# EAGLE design MBT42Q_CR2032_v01 (EAGLE 7.3.0)
COMPANY: ADAFRUIT INDUSTRIES; DRAWN: KTOWN; REV: F
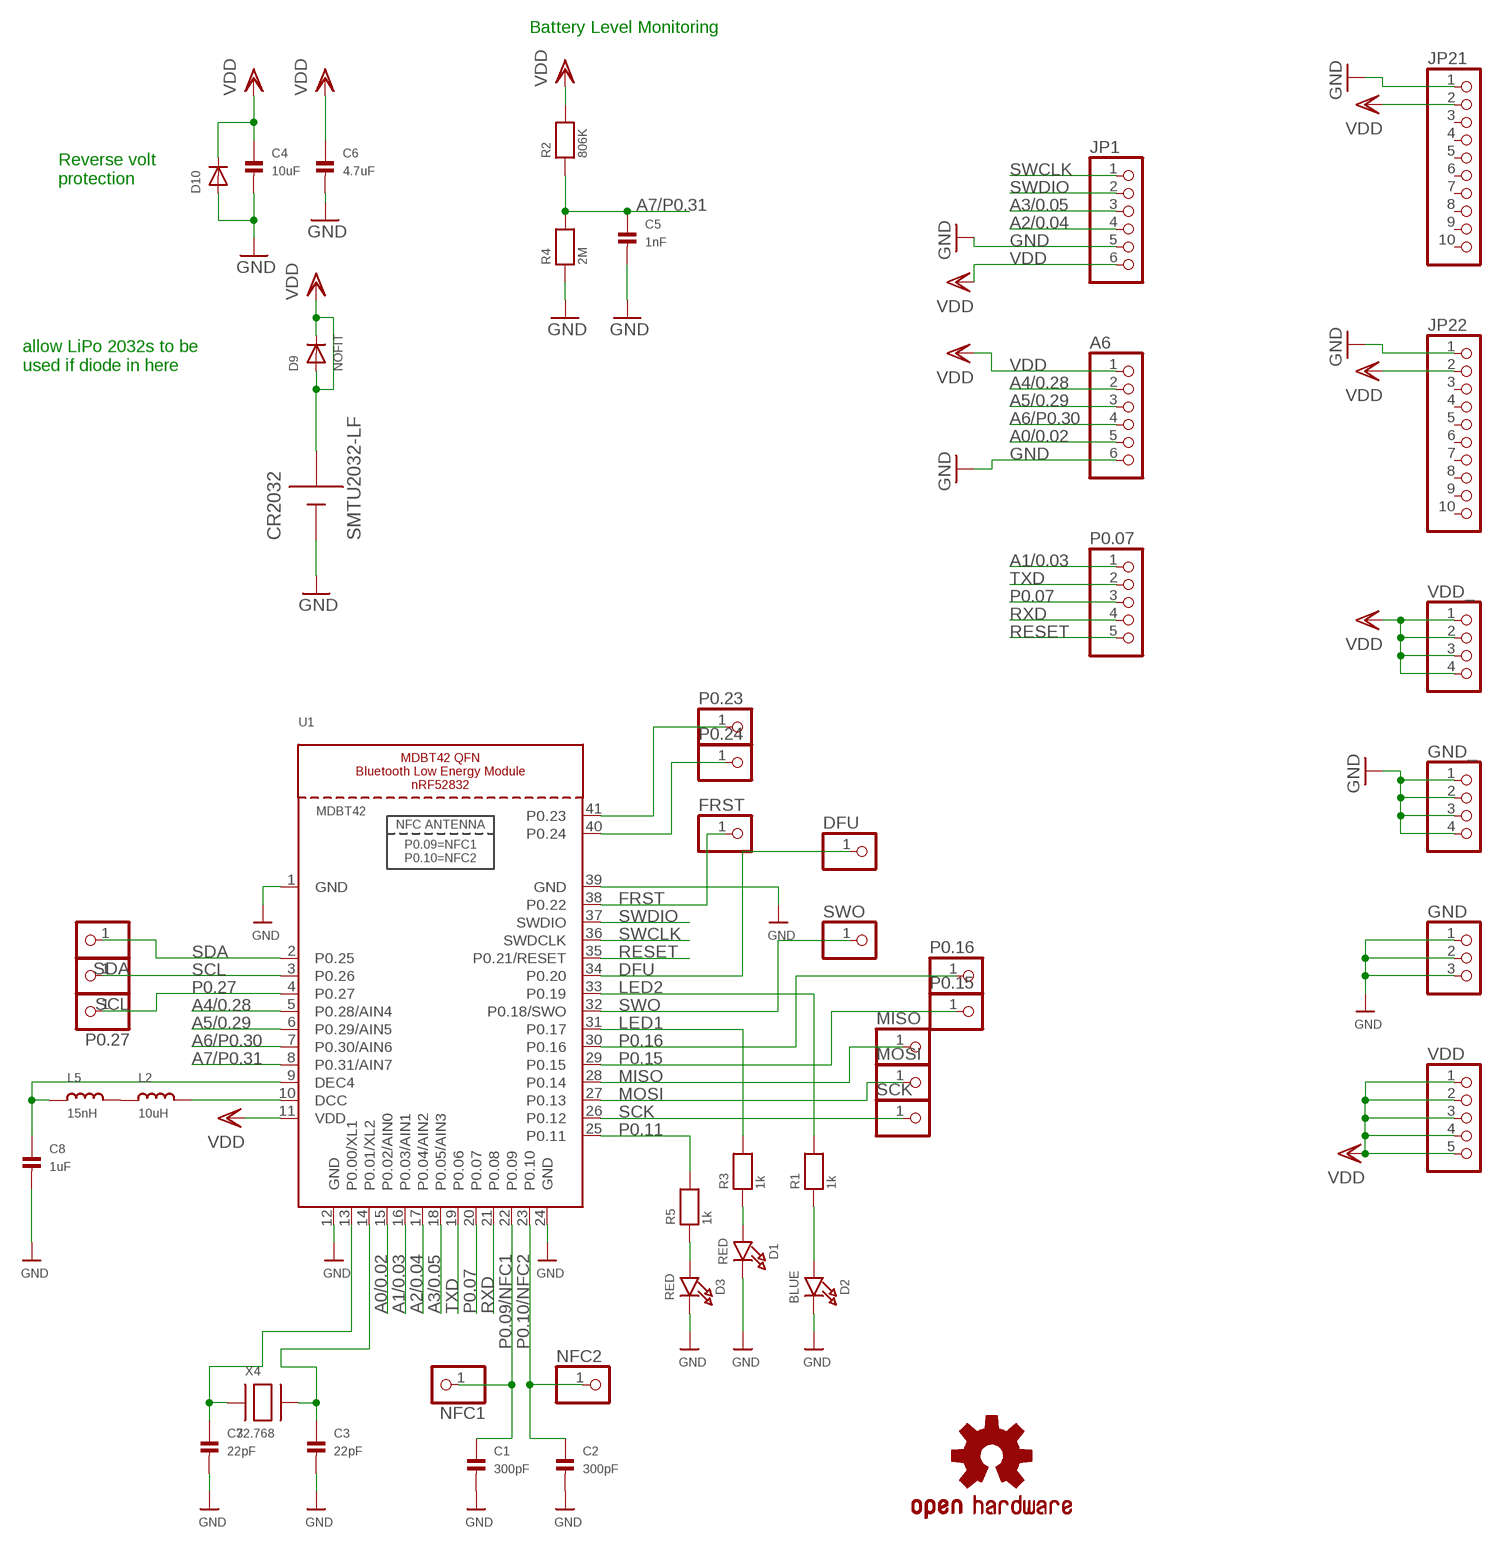
[diagram p0: schematic, sheet 1]

## Parts
A6  HEADER-1X6ROUND  [1X06_ROUND]
C1  300pF  CAP_CERAMIC0805  [0805]
C2  300pF  CAP_CERAMIC0805  [0805]
C3  22pF  CAP_CERAMIC0805  [0805]
C4  10uF  CAP_CERAMIC0805  [0805]
C5  1nF  CAP_CERAMIC0805  [0805]
C6  4.7uF  CAP_CERAMIC0805  [0805]
C7  22pF  CAP_CERAMIC0805  [0805]
C8  1uF  CAP_CERAMIC0805  [0805]
CR2032  SMTU2032-LF  [SMTU2032-LF]
D1  RED  LED0805_NOOUTLINE  [CHIPLED_0805_NOOUTLINE]
D2  BLUE  LED0805_NOOUTLINE  [CHIPLED_0805_NOOUTLINE]
D3  RED  LED0805_NOOUTLINE  [CHIPLED_0805_NOOUTLINE]
D9  NOFIT  DIODESOD-523  [SOD-523]
D10  DIODESOD-523  [SOD-523]
DFU  HEADER-1X1ROUND  [1X01_ROUND]
FRST  HEADER-1X1ROUND  [1X01_ROUND]
GND  HEADER-1X3ROUND  [1X03_ROUND]
GND_  HEADER-1X4ROUND  [1X04_ROUND]
JP1  HEADER-1X6ROUND  [1X06_ROUND]
JP21  HEADER-1X10ROUND  [1X10_ROUND]
JP22  HEADER-1X10ROUND  [1X10_ROUND]
L2  10uH  INDUCTOR_0805  [_0805]
L5  15nH  INDUCTOR_0805  [_0805]
LOGO1  OSHW-LOGOS  [OSHW-LOGO-S]
MISO  HEADER-1X1ROUND  [1X01_ROUND]
MOSI  HEADER-1X1ROUND  [1X01_ROUND]
NFC1  HEADER-1X1ROUND  [1X01_ROUND]
NFC2  HEADER-1X1ROUND  [1X01_ROUND]
P0.07  HEADER-1X5ROUND  [1X05_ROUND]
P0.15  HEADER-1X1ROUND  [1X01_ROUND]
P0.16  HEADER-1X1ROUND  [1X01_ROUND]
P0.23  HEADER-1X1ROUND  [1X01_ROUND]
P0.24  HEADER-1X1ROUND  [1X01_ROUND]
P0.27  HEADER-1X1ROUND  [1X01_ROUND]
R1  1k  RESISTOR0805  [0805]
R2  806K  RESISTOR0805  [0805]
R3  1k  RESISTOR0805  [0805]
R4  2M  RESISTOR0805  [0805]
R5  1k  RESISTOR0805  [0805]
SCK  HEADER-1X1ROUND  [1X01_ROUND]
SCL  HEADER-1X1ROUND  [1X01_ROUND]
SDA  HEADER-1X1ROUND  [1X01_ROUND]
SWO  HEADER-1X1ROUND  [1X01_ROUND]
U1  MDBT42  NRF52832_MODULE_MDBT42  [BLE_MODULE_RAYTAC_MDBT42]
VDD  HEADER-1X5ROUND  [1X05_ROUND]
VDD_  HEADER-1X4ROUND  [1X04_ROUND]
X4  32.768  XTAL-3.2X1.5  [XTAL3215]

## Nets
A0/0.02: A6.5 U1.15(P0.02/AIN0)
A1/0.03: P0.07.1 U1.16(P0.03/AIN1)
A2/0.04: JP1.4 U1.17(P0.04/AIN2)
A3/0.05: JP1.3 U1.18(P0.05/AIN3)
A4/0.28: A6.2 U1.5(P0.28/AIN4)
A5/0.29: A6.3 U1.6(P0.29/AIN5)
A6/P0.30: A6.4 U1.7(P0.30/AIN6)
A7/P0.31: C5.1 R2.1 R4.2 U1.8(P0.31/AIN7)
DFU: DFU.1 U1.34(P0.20)
FRST: FRST.1 U1.38(P0.22)
GND: A6.6 C1.2 C2.2 C3.2 C4.2 C5.2 C6.2 C7.2 C8.2 CR2032.P$2(GND) D1.C D2.C D3.C D10.A GND.1 GND.2 GND.3 GND_.1 GND_.2 GND_.3 GND_.4 JP1.5 JP21.1 JP22.1 R4.1 U1.1(GND) U1.12(GND) U1.24(GND) U1.39(GND)
LED1: R3.2 U1.31(P0.17)
LED2: R1.2 U1.33(P0.19)
MISO: MISO.1 U1.28(P0.14)
MOSI: MOSI.1 U1.27(P0.13)
N$1: C7.1 U1.13(P0.00/XL1) X4.P$1
N$2: C3.1 U1.14(P0.01/XL2) X4.P$2
N$3: L2.2 U1.10(DCC)
N$4: L2.1 L5.2
N$5: D1.A R3.1
N$6: D3.A R5.1
N$7: D2.A R1.1
N$8: C8.1 L5.1 U1.9(DEC4)
N$9: P0.24.1 U1.40(P0.24)
N$10: P0.23.1 U1.41(P0.23)
P0.07: P0.07.3 U1.20(P0.07)
P0.09/NFC1: C1.1 NFC1.1 U1.22(P0.09)
P0.10/NFC2: C2.1 NFC2.1 U1.23(P0.10)
P0.11: R5.2 U1.25(P0.11)
P0.15: P0.15.1 U1.29(P0.15)
P0.16: P0.16.1 U1.30(P0.16)
P0.27: P0.27.1 U1.4(P0.27)
RESET: P0.07.5 U1.35(P0.21/RESET)
RXD: P0.07.4 U1.21(P0.08)
SCK: SCK.1 U1.26(P0.12)
SCL: SCL.1 U1.3(P0.26)
SDA: SDA.1 U1.2(P0.25)
SWCLK: JP1.1 U1.36(SWDCLK)
SWDIO: JP1.2 U1.37(SWDIO)
SWO: SWO.1 U1.32(P0.18/SWO)
TXD: P0.07.2 U1.19(P0.06)
VDD: A6.1 C4.1 C6.1 CR2032.P$1(3V) D9.A D9.K(C) D10.K(C) JP1.6 JP21.2 JP22.2 R2.2 U1.11(VDD) VDD.1 VDD.2 VDD.3 VDD.4 VDD.5 VDD_.1 VDD_.2 VDD_.3 VDD_.4
Unconnected: JP21.3 JP21.4 JP21.5 JP21.6 JP21.7 JP21.8 JP21.9 JP21.10 JP22.3 JP22.4 JP22.5 JP22.6 JP22.7 JP22.8 JP22.9 JP22.10

## Notes on the sheet
- Battery Level Monitoring
- Reverse volt
  protection
- allow LiPo 2032s to be
  used if diode in here

## Library data of the parts
A6 JP1 = microbuilder:HEADER-1X6: PIN HEADER
C1-C8 = microbuilder:CAP_CERAMIC: Ceramic Capacitors 0402 - 0402 Surface Mount Capacitors 16pF 50V 5% [Digikey: 445-4899-2-ND] 18pF 50V 5% [Digikey: 490-1281-2-ND] 22pF 50V 5% [Digikey: 490-1283-2-ND] 68pF 50V 5% [Digikey: 490-1289-2-ND] 0.1uF 10V 10% [Digikey: 490-1318-2-ND] 1.0uF 6.3V 10% [Digikey: 490-1320-2-ND] 0603 - 0603 Surface Mount Capacitors 16 pF 50V 5% [Digikey: 445-5051-2-ND] 22 pF 50V [Digikey: PCC220ACVTR-ND] 33 pF 50V 5% [Digikey: 490-1415-1-ND] 56pF 50V 5% [Digikey: 490-1421-1-ND] 220pF 50V 5% [Digikey: 445-1285-1-ND] 680 pF 50V 2200 pF 50V 5% C0G [Digikey: 445-1297-1-ND] 5600 pF 100V 5% X7R [Digikey: 478-3711-1-ND] 0.1 µF 25V 10% [Digikey: PCC2277TR-ND] 0.22 µF 16V 10% X7R [Digikey: 445-1318-1-ND] 1.0 µF 25V 10% [Digikey: 445-5146-2-ND] 0603 - RF Specific 3pF 250V +/-0.1pF RF [Digikey: 712-1347-1-ND] 18 pF 250V 5% [Digikey: 478-3505-1-ND or 712-1322-1-ND] 56 pF 250V 5% C0G RF [Digikey: 490-4867-1-ND] 68 pF 250V RF [Digikey: 490-4868-1-ND] 0805 - 0805 Surface Mount Capacitors 220 pF 250V 2% RF Ceramic Capacitor [Digikey: 712-1398-1-ND] 1000 pF 50V 2% NP0 Ceramic Capacitor [Digikey: 478-3760-1-ND] 0.1 µF 25V 10% Ceramic Capacitor [Digikey: PCC1828TR-ND] 1.0 µF 16V 10% Ceramic Capacitor[Digikey: 490-1691-2-ND] 10.0 µF 10V 10% Ceramic Capacitor[Digikey: 709-1228-1-ND] 10.0 uF 16V 10% Ceramic Capacitor [Digikey: 478-5165-2-ND] 47 uF 6.3V 20% Ceramic Capacitor [Digikey: 587-1779-1-ND or 399-5506-1-ND] 1206 - 1206 Surface Mount Capacitors 47uF 10V 20% Ceramic Capacitor [Digikey: 490-5528-1-ND or 399-5508-1-ND or 445-6010-1-ND] 100uF 6.3V -20%, +80% Y5V Ceramic Capacitor (Digikey: 490-4512-1-ND, Mouser: 81-GRM31CF50J107ZE1L)
CR2032 = d3makers:SMTU2032-LF: SMT Battery Holder for CR2032 SMTU-2032-LF from renata http://www.renata.com/industrial-products/battery-holders/ http://www.mouser.jp/ProductDetail/Renata/SMTU2032-LF/
D1-D3 = microbuilder:LED: LED 0603 - 0603 Surface Mount Package 2mA: Green LED - Low Power (3.9mcd, 2ma, 1.7Vf) - Digikey: 475-2709-2-ND Orange LED - Low Power (9.8mcd, 2ma, 1.8Vf) - Digikey: 475-1194-2-ND Red LED - Low Power (5mcd, 2ma, 1.8Vf) - Digikey: 475-1195-2-ND Yellow LED - Low Power (7mcd, 2ma, 1.8Vf) - Digikey: 475-1196-2-ND 5mA: Blue LED - Low Power (17mcd, 5ma, 2.9Vf) - Digikey: LNJ937W8CRACT-ND 0805 - 0805 Surface Mount Package 2mA: Red LED (8.8mcd, 2mA, 1.8Vf, Clear) - Low Power [Digikey: 475-2510-1-ND] Green LED (5mcd, 2mA, 1.8Vf, Clear) - Low Power [Digikey: 475-2730-1-ND] Yellow LED (11.3mcd, 2mA, 1.8Vf, Clear) - Low Power [Digikey: 475-2555-1-ND] 20mA: Red LED (104mcd, 20mA, Diffused) - LS R976 [Digikey: 475-1278-6-ND] Red LED (12mcd, 20mA, 2.0Vf, Clear) - APT2012EC [Digikey: 754-1128-1-ND] Green LED (15mcd, 20mA, 2.2Vf, Clear) - APT2012GC [Digikey: 754-1131-1-ND] Orange LED (160mcd, 20mA, 2.1Vf, Clear) - APT2012SECK [Digikey: 754-1130-1-ND] 1206 - 1206 Surface Mount Package Green LED (26mcd, 20mA, Diffused) - LG N971 [Digikey: 475-1407-6-ND] Red LED (15mcd, 20mA, Diffused) - LH N974 [Digikey: 475-1416-6-ND] Cree - Cree High-Power Surface Mount LEDs XPEBWT-L1-0000-00D50 - White 111lm 350mA 2.9Vf 6200K 110° XTEAWT-00-0000-00000LEE3 - White 114lm 350mA 2.85Vf 5000K 115° Everlight - Everlight 45-21 Series Surface Mount LEDs 45-21/QK2C-B2832AC2CB2/2T - Warm White 2000mcd 20mA 3.25Vf 3050K 120° 45-21/LK2C-B38452C4CB2/2T - Nuetral White 2000mcd 20mA 3.25Vf 4150K 120° 45-21/LK2C-B50634C6CB2/2T - Cold White 2200mcd 20mA 3.25Vf 5650K 120° PLCC2 Reverse Mount LS T77K-J1L2-1-0-2-R18-Z - Red 11.25mcd 2mA 1.8Vf 630nm 120° LO T77K-L1M2-24-Z - Orange 19.6mcd 2mA 1.8Vf 606nm 120° LY T77K-K2M1-26-Z - Yellow 15.7mcd 2mA 1.8Vf 587nm 120°
D9 D10 = adafruit:DIODE: Diode SMADIODE - SMA Surface Mount Package 20V 1A Schottky Diode Digikey: 641-1014-6-ND DO-1N4148 - Through Hole Small Current Diode SOD-123 20V 1 A (.5mV Vf) Schottky Diode - Digikey: MBRX120TPMSCT-ND SOD-323 10V 570mA (.38mV Vf, 3ns) Schottky Diode - Digikey: ZLLS410CT-ND SOD-523 30V 30mA Schottky Diode (RB751S-40TE61) - Digikey: RB751S-40TE61CT-ND SOT23-R/W - SOT23 Package (R = Solder Paste/Reflow Ovens, W = Hand-Soldering) BAT54Film 40V 300mA - Digikey: 497-7162-1-ND
DFU FRST MISO MOSI NFC1 NFC2 P0.15 P0.16 P0.23 P0.24 P0.27 SCK SCL SDA SWO = microbuilder:HEADER-1X1: PIN HEADER
GND = microbuilder:HEADER-1X3: PIN HEADER
GND_ VDD_ = microbuilder:HEADER-1X4: PIN HEADER
JP21 JP22 = microbuilder:HEADER-1X10: PIN HEADER
L2 L5 = microbuilder:INDUCTOR: Inductors 0603: 10nH Ceramic Inductor - microwire antenna/RF (Digikey: 712-1434-2-ND) 0805: 560nH Ceramic Inductor - RF (Digikey: 553-1047-1-ND) 270nH Ceramic Inductor - Q = 40@250MHz, +-5%, 1 Ohm DC Resistance (Digikey: 535-10506-2-ND) 1007 (2518 Metric) SMT: 10µH 10% 250mOhm 820mA 1007 Inductor (Digikey: 587-2189-1-ND) 22µH 10% 500mOhm 580mA 1007 Inductor (Digikey: 587-2190-1-ND) 47µH 10% 950mOhm 420mA 1007 Inductor (Digikey: 587-2191-1-ND) 47µH 5% 100mOhm 1A 1008 Inductor (Digikey: 732-1816-1-ND) 5.0x5.0mm (Taiyo Yuden NR5040 Series) 6.8µH 20% 2.3A 64mOhm Inductor (Digikey: 587-2374-2-ND) 5.0x5.0mm (TDK VLC5045 Series) 4.7µH 20% 3.3A 34mOhm Inductor (Digikey: 445-6526-1-ND) 6.8µH 20% 2.7A 46mOhm Inductor (Digikey: 445-6527-1-ND) 6.0x6.0mm (TDK VLC6045 Series) 4.7µH 20% 3.8A 27mOhm Inductor (Digikey: 445-6538-2-ND) 6.8µH 20% 3A 41mOhm Inductor (Digikey: 445-6540-1-ND) 6.2µH 30% 2.2A 45mOhm Inductor (Digikey: SRR5028-6R2YCT-ND) - Not TDK VLC6045 but footprint should match 6.0x6.0mm (TDK SLF6045 Series) 6.8uH 30% 2A 33mOhm Inductor (Digikey: 445-4572-1-ND, Mouser: 810-SLF645T6R8N2R0PF)
LOGO1 = SparkFun-Aesthetics:OSHW-LOGO: Open Source Hardware Logo This logo indicates the piece of hardware it is found on incorporates a OSHW license and/or adheres to the definition of open source hardware found here: http://freedomdefined.org/OSHW
P0.07 VDD = microbuilder:HEADER-1X5: PIN HEADER
R1-R5 = microbuilder:RESISTOR: Resistors 0402 - 0402 Surface Mount Package 22 Ohm 1% 1/16W [Digikey: 311-22.0LRTR-ND] 33 Ohm 5% 1/16W 1.0K 5% 1/16W 1.5K 5% 1/16W 2.0K 1% 1/16W 10.0K 1% 1/16W [Digikey: 311-10.0KLRTR-ND] 10.0K 5% 1/16W [Digikey: RMCF0402JT10K0TR-ND] 12.1K 1% 1/16W [Digikey: 311-22.0LRTR-ND] 100.0K 5% 1/16W 0603 - 0603 Surface Mount Package 0 Ohm 1/10 Watt 1% Resistor 15 Ohm 1/10 Watt 1% Resistor 33 Ohm 1/10 Watt 1% Resistor 49.9 Ohm 1/10 Watt 1% Resistor 100 Ohm 1/10 Watt 1% Resistor 150 Ohm 1/10 Watt 1% Resistor 240 Ohm 1/10 Watt 1% Resistor 390 Ohm 1/10 Watt 1% Resistor 560 Ohm 1/10 Watt 1% Resistor 680 Ohm 1/10 Watt 1% Resistor 750 Ohm 1/10 Watt 1% Resistor 1.0K Ohm 1/10 Watt 1% Resistor 1.5K Ohm 1/10 Watt 1% Resistor 2.0K Ohm 1/10 Watt 1% Resistor 2.2K Ohm 1/10 Watt 1% Resistor 3.3K Ohm 1/10 Watt 1% Resistor 4.7K Ohm 1/10 Watt 1% Resistor 10.0K Ohm 1/10 Watt 1% Resistor 12.0K Ohm 1/10 Watt 1% Resistor 12.1K Ohm 1/10 Watt 1% Resistor 20.0K Ohm 1/10 Watt 1% Resistor 33.0K Ohm 1/10 Watt 1% Resistor 100.0K Ohm 1/10 Watt 1% Resistor 0805 - 0805 Surface Mount Package 0 Ohm 1/8 Watt 1% Resistor 33 Ohm 1/8 Watt 1% Resistor 100 Ohm 1/8 Watt 1% Resistor 150 Ohm 1/8 Watt 1% Resistor 200 Ohm 1/8 Watt 1% Resistor 240 Ohm 1/8 Watt 1% Resistor 330 Ohm 1/8 Watt 1% Resistor 390 Ohm 1/8 Watt 1% Resistor 470 Ohm 1/8 Watt 1% Resistor 1.0K Ohm 1/8 Watt 1% Resistor 1.5K Ohm 1/8 Watt 1% Resistor 2.0K Ohm 1/8 Watt 1% Resistor 4.7K Ohm 1/8 Watt 1% Resistor 5.1K Ohm 1/8 Watt 1% Resistor 5.6K Ohm 1/8 Watt 1% Resistor 10.0K Ohm 1/8 Watt 1% Resistor 22.0K Ohm 1/8 Watt 1% Resistor 33.0K Ohm 1/8 Watt 1% Resistor 100K Ohm 1/8 Watt 1% Resistor 1206 - 1206 Surface Mount Package 2012 - 2010 Surface Mount Package 0.11 Ohm 1/2 Watt 1% Resistor - Digikey: RHM.11UCT-ND
U1 = microbuilder:NRF52832_MODULE_MDBT42: MDBT42 - BLE Module (nRF52832 QFN) VDD: 1.7-3.6V
X4 = adafruit2:XTAL: Low cost SMT crystals, no capacitors included http://www.ladyada.net/library/eagle

## Net classes
2 power: width 0.203 mm
3 usbvcc: width 0.305 mm, drill 0.483 mm, clearance 0.203 mm

## Board
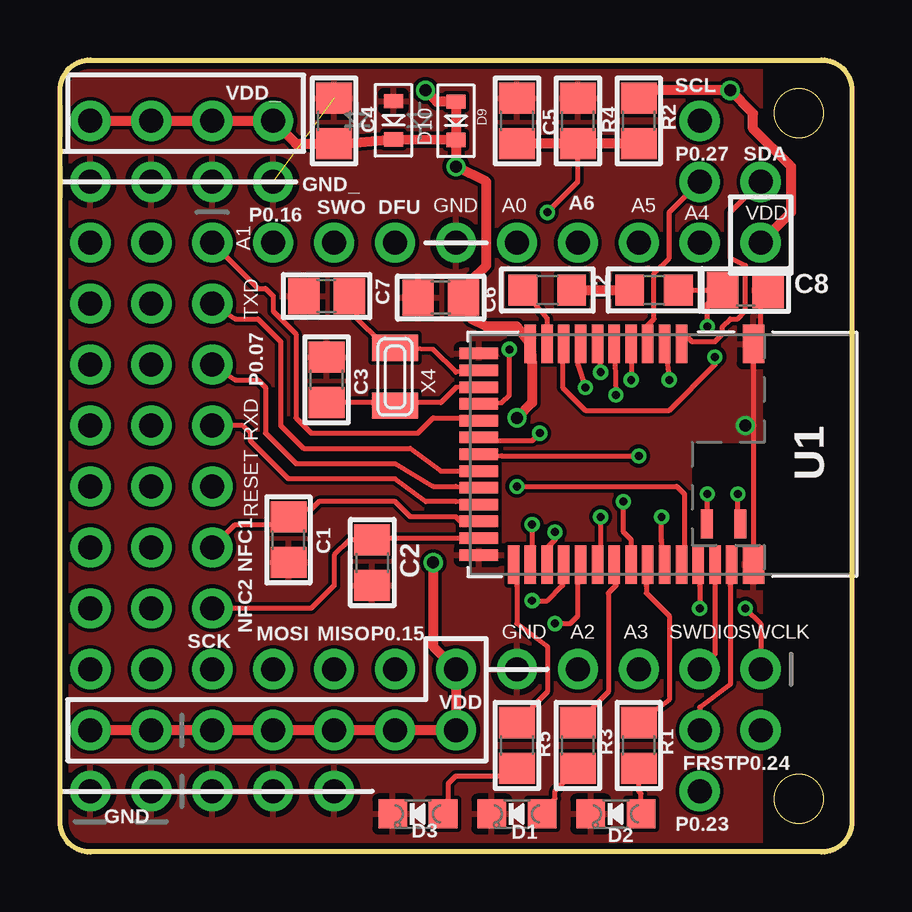
[diagram p1: board, top side]
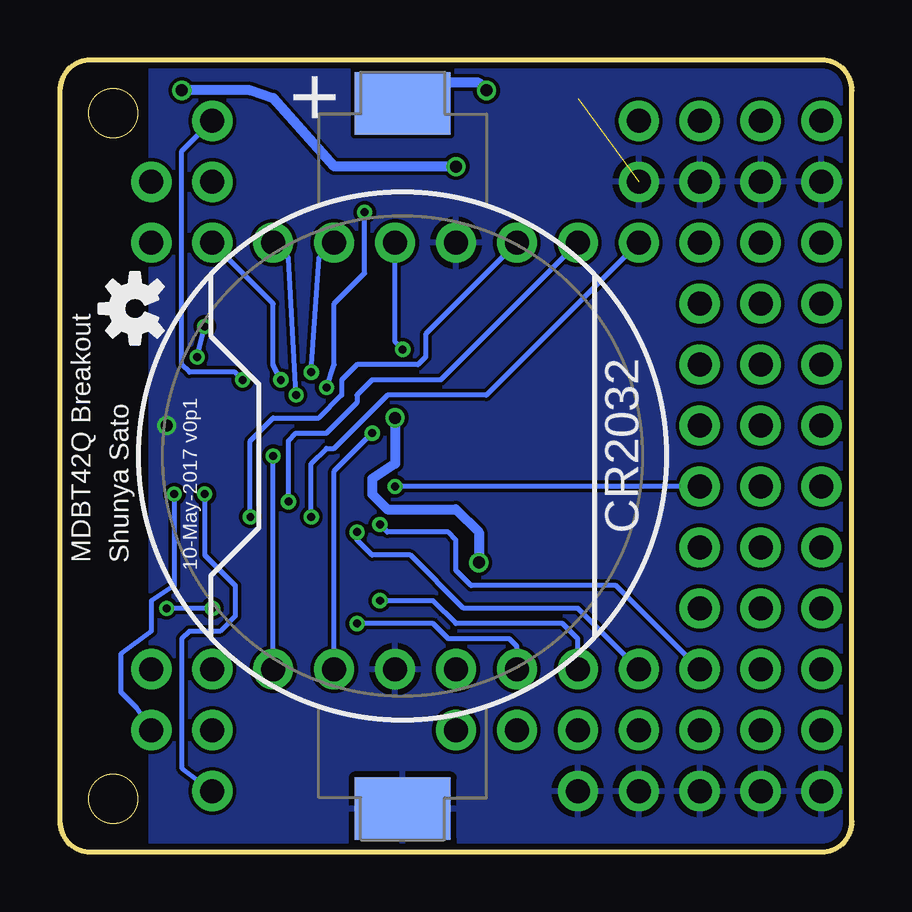
[diagram p2: board, bottom side, seen from below]

Size 33.02 x 33.02 mm. Coordinates in mm from the lower left corner, seen from the top.
Outline: 1.27,33.02 31.75,33.02 arc-90 33.02,31.75 33.02,1.27 arc-90 31.75,0 1.27,0 arc-90 0,1.27 0,31.75 arc-90 1.27,33.02
Outline: circle at 30.8,2.22 radius 1.02
Outline: circle at 30.8,30.8 radius 1.02
Copper layers (1*16): Top 0.035mm / dielectric 1.5mm / Bottom 0.035mm
Design rules "SeeedStudio_2layer_DRU_no_angle_20140221": minimum track width 6mil, minimum drill 12mil, track to track 6mil, track to pad 6mil, pad to pad 6mil, via to via 6mil, smd to smd 0mil, copper to edge 10mil, drill to drill 10mil, minimum pad ring 10mil, minimum via ring 6mil, stop-mask expansion 2mil, vias tented up to drill 100mil, thermal gap 10mil

### Footprints (pad centres in the part's own frame; a part is rotated, then mirrored left to right if it is on the bottom)
1X06_ROUND = drill 1 pad 1.676: 1 -6.35,0; 2 -3.81,0; 3 -1.27,0; 4 1.27,0; 5 3.81,0; 6 6.35,0
0805 = smd 1.3 x 1.5: 1 -0.95,0; 2 0.95,0
SMTU2032-LF = smd 2.6 x 4: P$1 -14.7,0; P$2 14.7,0
CHIPLED_0805_NOOUTLINE = smd 1.2 x 1.2: A 0,-1.05; C 0,1.05
SOD-523 = smd 0.8 x 0.6: A 0,-0.8; K 0,0.8
1X01_ROUND = drill 1 pad 1.676: 1 0,0
1X03_ROUND = drill 1 pad 1.676: 1 -2.54,0; 2 0,0; 3 2.54,0
1X04_ROUND = drill 1 pad 1.676: 1 -3.81,0; 2 -1.27,0; 3 1.27,0; 4 3.81,0
1X10_ROUND = drill 1 pad 1.676: 1 -11.43,0; 2 -8.89,0; 3 -6.35,0; 4 -3.81,0; 5 -1.27,0; 6 1.27,0; 7 3.81,0; 8 6.35,0; 9 8.89,0; 10 11.43,0
_0805 = smd 1.2 x 1.3: 1 -1.016,0; 2 1.016,0
1X05_ROUND = drill 1 pad 1.676: 1 -5.08,0; 2 -2.54,0; 3 0,0; 4 2.54,0; 5 5.08,0
BLE_MODULE_RAYTAC_MDBT42 = smd 1.6 x 0.9: 1 -4.6,3.8; 39 4.6,3.8 | smd 1.6 x 0.48: 2 -4.6,0.8; 3 -4.6,0.1; 4 -4.6,-0.6; 5 -4.6,-1.3; 6 -4.6,-2; 7 -4.6,-2.7; 8 -4.6,-3.4; 9 -4.6,-4.1; 10 -4.6,-4.8; 11 -4.6,-5.5; 25 4.6,-6.2; 26 4.6,-5.5; 27 4.6,-4.8; 28 4.6,-4.1; 29 4.6,-3.4; 30 4.6,-2.7; 31 4.6,-2; 32 4.6,-1.3; 33 4.6,-0.6; 34 4.6,0.1; 35 4.6,0.8; 36 4.6,1.5; 37 4.6,2.2; 38 4.6,2.9 | smd 0.48 x 1.6: 12 -4.2,-7.65; 13 -3.5,-7.65; 14 -2.8,-7.65; 15 -2.1,-7.65; 16 -1.4,-7.65; 17 -0.7,-7.65; 18 0,-7.65; 19 0.7,-7.65; 20 1.4,-7.65; 21 2.1,-7.65; 22 2.8,-7.65; 23 3.5,-7.65; 24 4.2,-7.65 | smd 1.2 x 0.5: 40 2.9,3.25; 41 2.9,1.85
XTAL3215 = smd 1.1 x 1.9: P$1 1.2,0; P$2 -1.2,0

### Placement (x,y rotation side)
A6  22.86,25.4 180 top
C1  9.52,13.02 270 top
C2  13.02,12.07 270 top
C3  11.11,19.69 90 top
C4  11.43,30.48 90 top
C5  19.05,30.48 90 top
C6  15.88,23.11 180 top
C7  11.11,23.18 180 top
C8  28.57,23.43 0 top
CR2032  18.73,16.51 270 bottom
D1  19.05,1.59 90 top
D2  23.18,1.59 90 top
D3  14.92,1.59 90 top
D9  16.51,30.48 180 top
D10  13.9,30.5 180 top
DFU  13.97,25.4 0 top
FRST  26.67,5.08 0 top
GND  8.89,2.54 0 top
GND_  5.08,27.94 0 top
JP1  22.86,7.62 180 top
JP21  1.27,13.97 90 top
JP22  3.81,13.97 90 top
L2  20.32,23.43 180 top
L5  24.77,23.43 180 top
LOGO1  29.9,22.66 90 bottom
MISO  11.43,7.62 0 top
MOSI  8.89,7.62 0 top
NFC1  6.35,12.7 0 top
NFC2  6.35,10.16 0 top
P0.07  6.35,20.32 270 top
P0.15  13.97,7.62 0 top
P0.16  8.89,25.4 0 top
P0.23  26.67,2.54 0 top
P0.24  29.21,5.08 0 top
P0.27  26.67,27.94 0 top
R1  24.13,4.45 90 top
R2  24.13,30.48 90 top
R3  21.59,4.45 90 top
R4  21.59,30.48 270 top
R5  19.05,4.45 90 top
SCK  6.35,7.62 0 top
SCL  26.67,30.48 0 top
SDA  29.21,27.94 0 top
SWO  11.43,25.4 0 top
U1  25.11,16.58 270 top
VDD  11.43,5.08 0 top
VDD_  5.08,30.48 0 top
X4  13.97,19.81 90 top

### Tracks (layer width: path | path; a pad name or v marks a point on that pad's centre or on a via)
A0/0.02  (via drill 0.33)
  Top 0.203: U1.15 18.41,18.73 18.73,19.05 v18.73,20.96
  Bottom 0.203: v18.73,20.96 19.05,21.27 A6.5
A1/0.03
  Top 0.203: P0.07.1 8.26,23.5 8.57,23.5 8.89,23.18 8.89,22.54 9.84,21.59 9.84,18.1 10.48,17.46 14.92,17.46 15.56,18.1 16.83,18.1 U1.16
A2/0.04  (via drill 0.33)
  Top 0.203: v20,17.46 19.69,17.14 18.1,17.14 U1.17
  Bottom 0.203: JP1.4 21.59,15.88 v20,17.46
A3/0.05  (via drill 0.33)
  Top 0.203: U1.18 18.41,16.51 v24.13,16.51
  Bottom 0.203: JP1.3 v24.13,16.51
A4/0.28  (via drill 0.33)
  Top 0.203: U1.5 v23.81,19.69
  Bottom 0.203: v23.81,19.69 24.13,20.32 24.13,22.86 A6.2
A5/0.29  (via drill 0.33)
  Top 0.203: U1.6 v23.18,19.05
  Bottom 0.203: v23.18,19.05 23.49,24.77 A6.3
A6/P0.30  (via drill 0.33)
  Top 0.203: U1.7 v22.54,20
  Bottom 0.203: v22.54,20 22.23,24.77 A6.4
A7/P0.31  (via drill 0.33)
  Top 0.203: U1.8 21.59,20.32 v21.91,19.37 | v20.32,26.67 21.59,27.94 R4.2
  Top 0.406: R2.1 R4.2 C5.1
  Bottom 0.203: v21.91,19.37 21.59,20.32 21.59,22.86 20.32,24.13 v20.32,26.67
DFU  (via drill 0.33)
  Top 0.203: U1.34 25.08,13.02 v25.08,13.97
  Bottom 0.203: DFU.1 17.78,21.59 17.78,20.64 18.1,20.32 20.64,20.32 21.27,19.69 21.27,19.05 22.23,18.1 24.13,18.1 25.08,17.14 v25.08,13.97
FRST
  Top 0.203: U1.38 27.94,11.11 27.94,6.99 26.67,6.03 FRST.1
GND  (via drill 0.5)  (1 unrouted)
  Top 0.203: U1.39 U1.1 28.91,21.61 29.21,21.91 29.21,23.12 C8.2 29.53,23.12
  other vias: 28.57,17.78
  pour Top: 0,33.02 0,0 29.21,0 29.21,33.02
  pour Bottom: 0,33.02 0,0 29.21,0 29.21,33.02
LED1
  Top 0.203: U1.31 23.18,11.11 22.86,10.8 22.86,6.67 R3.2
LED2
  Top 0.203: U1.33 24.45,11.11 24.45,10.8 25.4,9.84 25.4,6.35 R1.2
MISO  (via drill 0.33)
  Top 0.203: v19.69,10.48 20.32,10.48 20.95,11.11 20.95,11.93 U1.28
  Bottom 0.203: MISO.1 11.43,8.89 12.06,9.52 16.51,9.52 17.46,10.48 v19.69,10.48
MOSI  (via drill 0.33)
  Top 0.203: v20.64,13.34 20.64,13.02 20.32,12.7 20.32,11.99 U1.27
  Bottom 0.203: MOSI.1 11.43,10.16 16.19,10.16 18.41,12.38 20,12.38 20.64,13.02 v20.64,13.34
N$1
  Top 0.203: U1.13 16.51,20 15.56,20.96 X4.P$1 13.34,21.27 12.38,22.23 12.38,22.54 C7.1
N$2
  Top 0.203: U1.14 16.51,19.37 15.88,18.73 14.92,18.73 X4.P$2 13.02,18.73 C3.1
N$3
  Top 0.203: U1.10 20.32,22.23 L2.2
N$4
  Top 0.406: L2.1 L5.2
N$5
  Top 0.203: D1.A 20.1,1.68 20.64,2.22 20.64,2.54 20.95,2.86 R3.1
N$6
  Top 0.203: D3.A 15.97,2 16.19,2.22 16.19,2.86 16.51,3.17 18.73,3.17 R5.1
N$7
  Top 0.203: D2.A 24.23,2.44 24.13,2.54 R1.1
N$8  (via drill 0.33)
  Top 0.203: U1.9 20.95,20.32 20.95,19.37 21.91,18.41 25.4,18.41 27.3,20.32 v27.3,20.64 | v26.99,21.91 26.99,22.86 27.05,22.86 C8.1 L5.1
  Bottom 0.203: v27.3,20.64 v26.99,21.91
N$9  (via drill 0.33)
  Top 0.203: U1.40 28.26,14.29 v28.26,14.92
  Bottom 0.203: v28.26,14.92 28.26,11.11 29.21,10.48 29.21,9.21 30.48,8.25 30.48,6.67 29.84,6.03 P0.24.1
N$10  (via drill 0.33)
  Top 0.203: U1.41 26.99,14.29 v26.99,14.92
  Bottom 0.203: v26.99,14.92 26.99,12.38 25.72,11.11 25.72,9.84 26.35,9.21 27.62,9.21 27.94,8.89 27.94,3.49 P0.23.1
P0.07
  Top 0.203: P0.07.3 7.3,19.69 8.26,19.69 8.57,19.37 8.57,17.46 9.84,16.19 13.97,16.19 15.56,15.24 16.51,15.24 U1.20
P0.09/NFC1
  Top 0.203: U1.22 16.7,13.78 16.51,13.97 14.6,13.97 13.97,14.61 10.8,14.61 10.48,14.29 9.84,14.29 C1.1 9.21,13.65 7.3,13.65 NFC1.1
P0.10/NFC2
  Top 0.203: U1.23 13.09,13.08 C2.1 12.38,13.02 12.06,13.02 11.43,12.38 11.43,11.11 10.48,10.16 NFC2.1
P0.11
  Top 0.203: U1.25 19.05,11.11 19.05,9.52 20.32,8.57 20.32,6.67 19.69,6.03 R5.2
P0.15  (via drill 0.33)
  Top 0.203: v20.64,9.52 21.27,9.52 21.59,9.84 21.59,11.86 U1.29
  Bottom 0.203: P0.15.1 13.97,8.57 14.29,8.89 16.83,8.89 17.46,9.52 v20.64,9.52
P0.16  (via drill 0.33)
  Top 0.203: U1.30 22.54,12.7 v22.54,13.97
  Bottom 0.203: P0.16.1 15.24,19.05 19.37,19.05 21.59,16.83 21.91,16.83 22.54,16.19 v22.54,13.97
P0.27
  Top 0.203: U1.4 24.45,21.91 24.77,22.23 24.77,24.13 25.4,24.77 25.4,26.67 P0.27.1
RESET  (via drill 0.33)
  Top 0.203: v19.05,15.24 25.72,15.24 26.03,14.92 26.03,12.7 U1.35
  Bottom 0.203: P0.07.5 v19.05,15.24
RXD
  Top 0.203: U1.21 16.51,14.61 15.24,14.61 13.97,15.56 9.52,15.56 7.94,17.14 7.94,17.46 7.62,17.78 P0.07.4
SCK  (via drill 0.33)
  Top 0.203: v19.69,13.65 19.69,12.7 U1.26
  Bottom 0.203: SCK.1 9.84,11.11 15.88,11.11 16.51,11.75 16.51,13.02 16.83,13.34 19.37,13.34 v19.69,13.65
SCL  (via drill 0.33)
  Top 0.203: U1.3 v25.4,19.69
  Bottom 0.203: v25.4,19.69 25.72,20 27.62,20 27.94,20.32 27.94,29.21 SCL.1
SDA
  Top 0.203: U1.2 26.03,21.59 26.35,21.27 27.3,21.27 27.62,21.59 27.62,21.91 27.94,22.23 28.26,22.23 28.57,22.54 28.57,24.45 27.94,24.77 27.94,26.67 SDA.1
SWCLK  (via drill 0.33)
  Top 0.203: U1.36 26.67,11.11 v26.67,10.16 | v28.57,10.16 29.21,9.52 JP1.1
  Bottom 0.203: v26.67,10.16 v28.57,10.16
SWDIO
  Top 0.203: U1.37 27.3,11.11 27.3,8.25 JP1.2
SWO  (via drill 0.33)
  Top 0.203: U1.32 23.81,13.02 23.49,13.34 v23.49,14.61
  Bottom 0.203: SWO.1 17.14,19.69 20,19.69 20.64,19.05 20.64,18.73 21.91,17.46 23.18,17.46 23.49,17.14 v23.49,14.61
TXD
  Top 0.203: P0.07.2 7.3,22.23 8.26,22.23 9.21,21.27 9.21,17.78 10.16,16.83 14.6,16.83 15.88,15.88 16.83,15.88 U1.19
VDD  (via drill 0.5)
  Top 0.203: 24.77,31.75 R2.2
  Top 0.406: A6.1 30.48,26.67 30.48,28.57 28.89,30.16 28.89,30.8 v27.94,31.75 24.77,31.75 | D9.K D9.A 15.71,31.28 v15.24,31.75 | D9.K D10.K 12.06,29.53 C4.1 9.84,29.53 VDD_.4 VDD_.3 VDD_.2 VDD_.1 | D9.K v16.51,28.57 17.78,27.94 17.78,24.45 17.14,23.81 C6.1 17.14,22.23 17.78,21.91 19.05,21.91 U1.11 19.69,20.32 19.69,18.73 v19.05,18.1 | v15.56,12.07 15.56,8.57 JP1.6 VDD.5 VDD.4 VDD.3 VDD.2 VDD.1 JP22.2 JP21.2
  Bottom 0.406: v15.24,31.75 15.56,32.07 17.46,32.07 CR2032.P$1 | v16.51,28.57 21.59,28.57 R2.2 25.08,31.75 v27.94,31.75 | v19.05,18.1 19.05,16.19 20,15.56 20,14.92 19.37,14.29 16.51,14.29 15.56,13.34 v15.56,12.07

### Text on the board
bPlace: Shunya Sato | MDBT42Q Breakout | 10-May-2017 v0p1
tNames: GND | A0 | A5 | A4 | VDD | A1 | TXD | RXD | RESET | GND | A2 | A3 | SWDIO | SWCLK